# Altium schematic sheet Controller.SchDoc: STM32 Bluepill
size A3; Revision: No; SheetNumber: 1; SheetTotal: 1
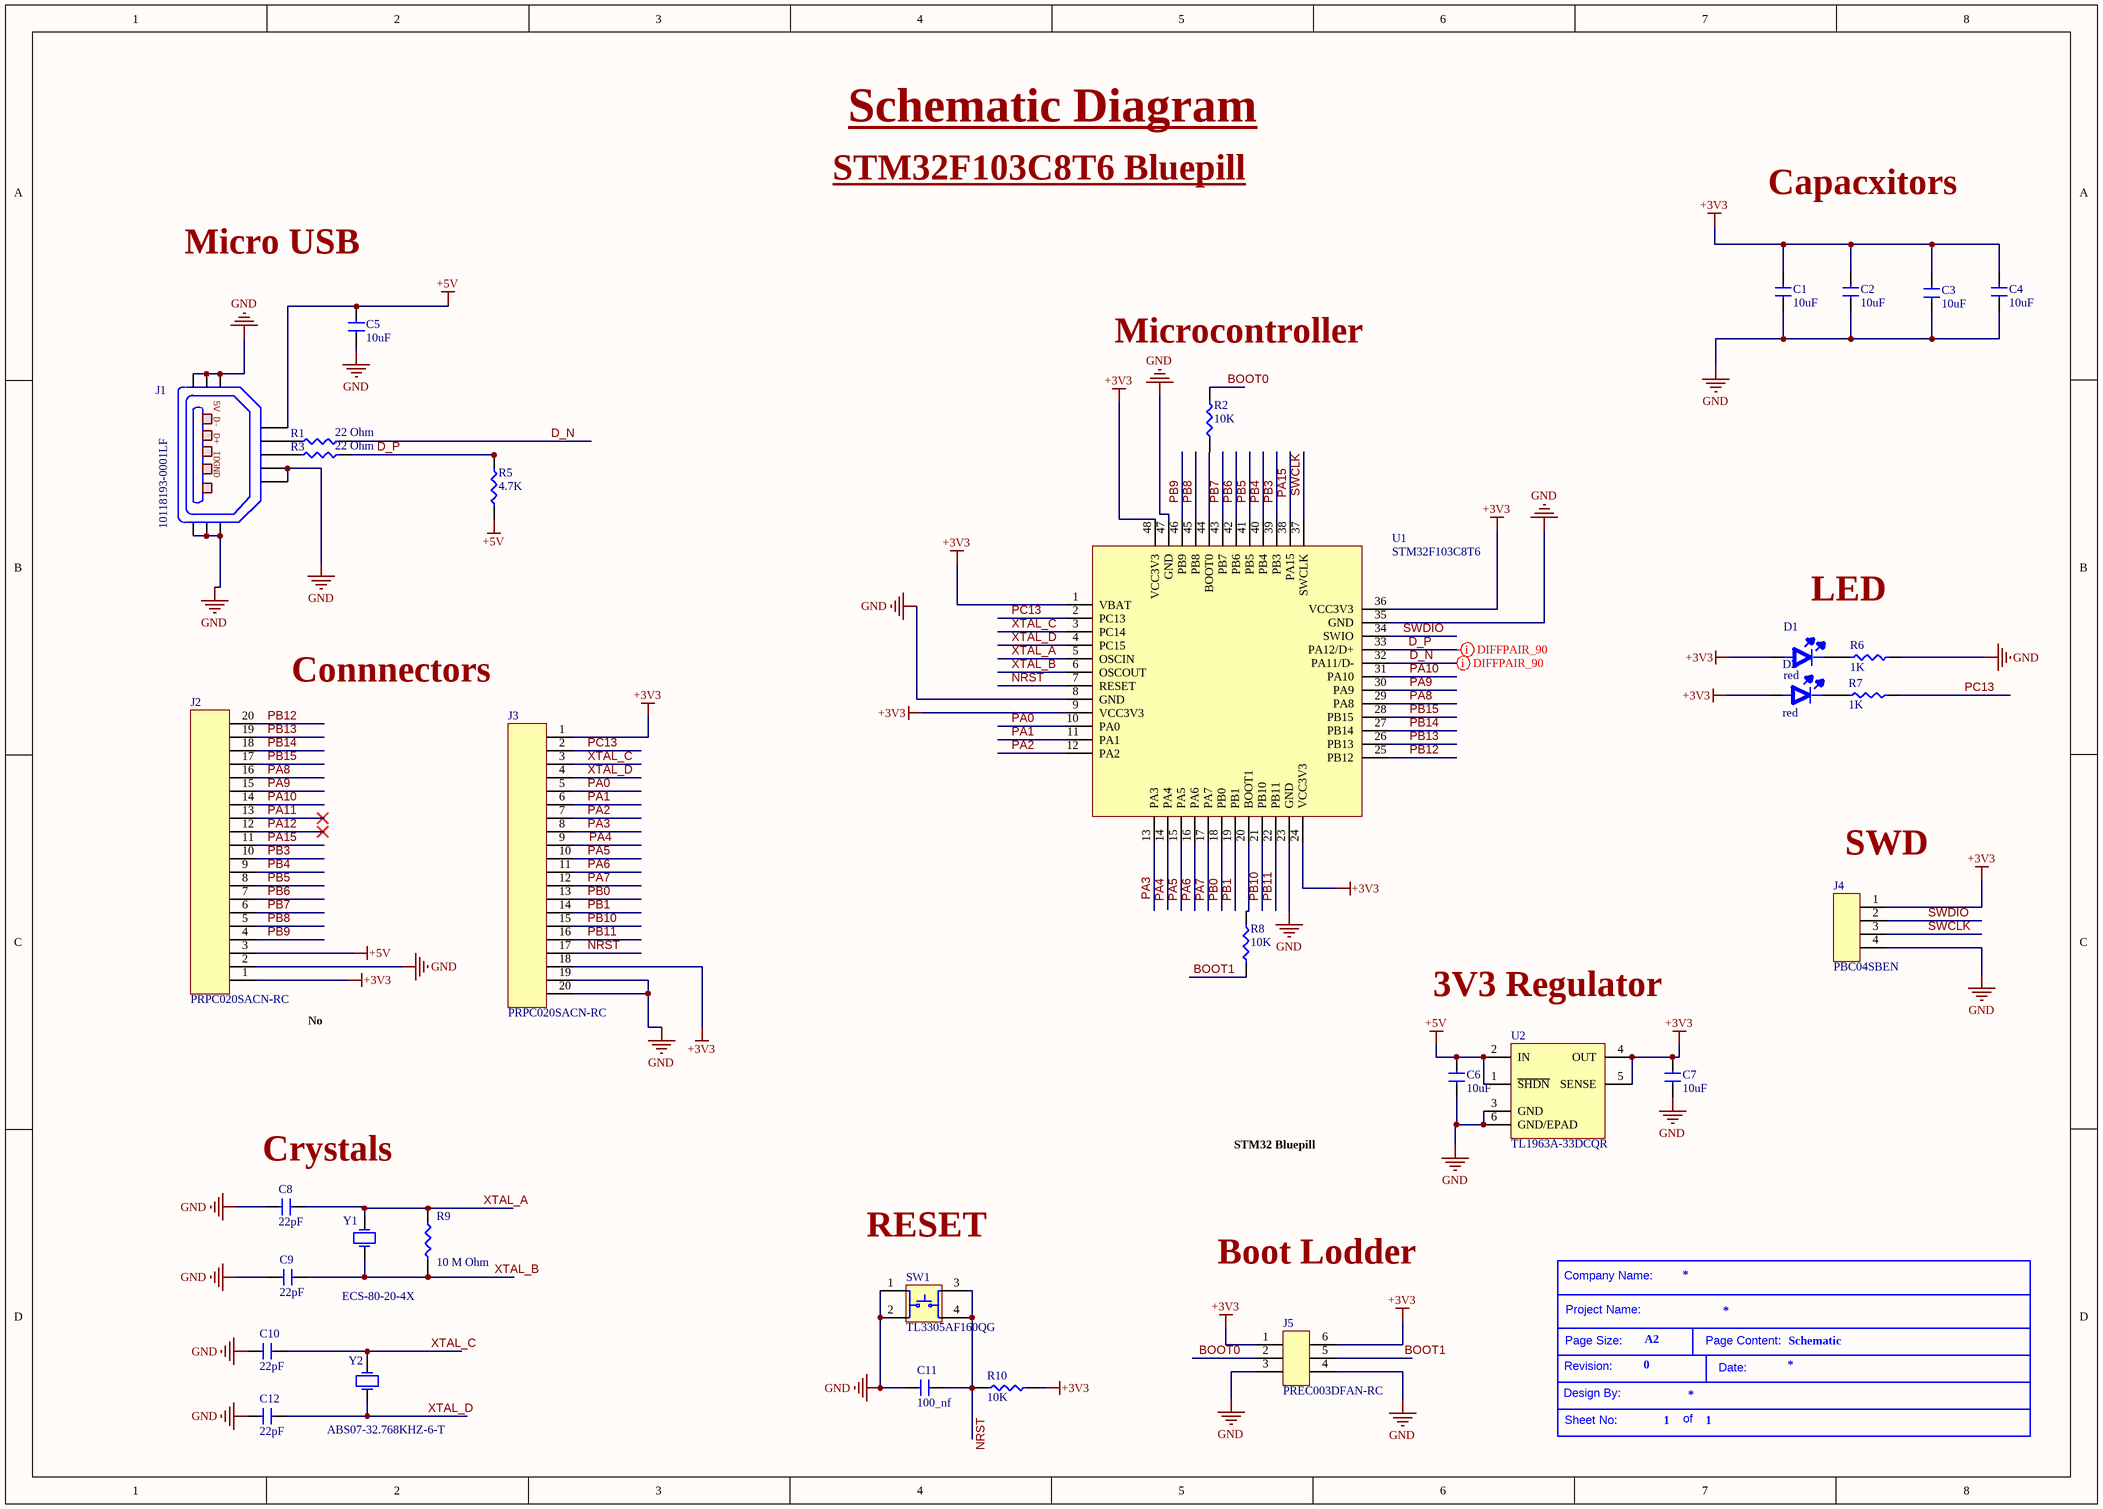
[diagram p0: Controller.SchDoc]

## Parts
*  Title_Block  (value not drawn)  (mechanical)
C1  10uF  [CAP_100_nf]
C2  10uF  [CAP_100_nf]
C3  10uF  [CAP_100_nf]
C4  10uF  [CAP_100_nf]
C5  10uF  [CAP_100_nf]
C6  10uF  [CAP_100_nf]
C7  10uF  [CAP_100_nf]
C8  22pF  [CAP_100_nf]
C9  22pF  [CAP_100_nf]
C10  22pF  [CAP_100_nf]
C11  100_nf  [CAP_100_nf]
C12  22pF  [CAP_100_nf]
D1  red  [LED_RED_0805]
D2  red  [LED_RED_0805]
J1  10118193-0001LF  [USB]
J2  PRPC020SACN-RC  [HDR MALE 20X1 2.54 mm]
J3  PRPC020SACN-RC  [HDR MALE 20X1 2.54 mm]
J4  PBC04SBEN  [HDR MALE 4X1 2.54 mm]
J5  PREC003DFAN-RC  [HDR_MALE_3X2_2.54mm]
R1  22 Ohm  [R0805]
R2  10K  [R0805]
R3  22 Ohm  [R0805]
R5  4.7K  [R0805]
R6  1K  [R0805]
R7  1K  [R0805]
R8  10K  [R0805]
R9  10 M Ohm  [R0805]
R10  10K  [R0805]
SW1  TL3305AF160QG  [SW_PB_SMD]
U1  STM32F103C8T6  [STM32F103C8T6]
U2  TL1963A-33DCQR  [DCQR_PDSO_G6]
Y1  ECS-80-20-4X  [XTAL_8_MHZ]
Y2  ABS07-32.768KHZ-6-T  [XTAL_32.768 KHZ_SMD]

## Nets
+3V3: C1.1 C2.1 C3.1 C4.1 C7.2 D1.2(Anode) D2.2(Anode) J2.1 J3.1 J3.18 J4.1 J5.1 J5.6 R10.2 U1.1(VBAT) U1.9(VCC3V3) U1.24(VCC3V3) U1.36(VCC3V3) U1.48(VCC3V3) U2.4(OUT) U2.5(SENSE)
+5V: C5.1 C6.2 J1.1 J2.3 R5.2 U2.1(~{SHDN}) U2.2(IN)
GND: C1.2 C2.2 C3.2 C4.2 C5.2 C6.1 C7.1 C8.1 C9.1 C10.1 C11.1 C12.1 J1.4 J1.5 J1.6 J1.7 J1.8 J1.9 J1.10 J1.11 J2.2 J3.19 J3.20 J4.4 J5.3 J5.4 R6.2 SW1.1 SW1.2 U1.8(GND) U1.23(GND) U1.35(GND) U1.47(GND) U2.3(GND) U2.6(GND/EPAD)
BOOT0: J5.2 R2.2
BOOT1: J5.5 R8.2
D_N: R1.2 U1.32(PA11/D-)
D_P: R3.2 R5.1 U1.33(PA12/D+)
NRST: C11.2 J3.17 R10.1 SW1.3 SW1.4 U1.7(RESET)
PA0: J3.5 U1.10(PA0)
PA1: J3.6 U1.11(PA1)
PA2: J3.7 U1.12(PA2)
PA3: J3.8 U1.13(PA3)
PA4: J3.9 U1.14(PA4)
PA5: J3.10 U1.15(PA5)
PA6: J3.11 U1.16(PA6)
PA7: J3.12 U1.17(PA7)
PA8: J2.16 U1.29(PA8)
PA9: J2.15 U1.30(PA9)
PA10: J2.14 U1.31(PA10)
PA11: J2.13
PA12: J2.12
PA15: J2.11 U1.38(PA15)
PB0: J3.13 U1.18(PB0)
PB1: J3.14 U1.19(PB1)
PB3: J2.10 U1.39(PB3)
PB4: J2.9 U1.40(PB4)
PB5: J2.8 U1.41(PB5)
PB6: J2.7 U1.42(PB6)
PB7: J2.6 U1.43(PB7)
PB8: J2.5 U1.45(PB8)
PB9: J2.4 U1.46(PB9)
PB10: J3.15 U1.21(PB10)
PB11: J3.16 U1.22(PB11)
PB12: J2.20 U1.25(PB12)
PB13: J2.19 U1.26(PB13)
PB14: J2.18 U1.27(PB14)
PB15: J2.17 U1.28(PB15)
PC13: J3.2 R7.1 U1.2(PC13)
SWCLK: J4.3 U1.37(SWCLK)
SWDIO: J4.2 U1.34(SWIO)
XTAL_A: C8.2 R9.1 U1.5(OSCIN) Y1.1
XTAL_B: C9.2 R9.2 U1.6(OSCOUT) Y1.2
XTAL_C: C10.2 J3.3 U1.3(PC14) Y2.1
XTAL_D: C12.2 J3.4 U1.4(PC15) Y2.2
NetD1_1: D1.1(Cathode) R6.1
NetD2_1: D2.1(Cathode) R7.2
NetJ1_2: J1.2 R1.1
NetJ1_3: J1.3 R3.1
NetR2_1: R2.1 U1.44(BOOT0)
NetR8_1: R8.1 U1.20(BOOT1)

## Layout directives
differential pair; differential pair class diff_90: D_N, D_P

## Notes on the sheet
- Schematic Diagram
- STM32F103C8T6 Bluepill
- Capacxitors
- Micro USB
- (near R2) Microcontroller
- LED
- Connnectors
- (near J4) SWD
- 3V3 Regulator
- Crystals
- (near SW1) RESET
- Boot Lodder
- 0
- A2
- Schematic
- (in symbol Micro_USB) 5V; D-; D+; ID; GND
- (in symbol Title_Block) Company Name:; Project Name:; Page Size:; Page Content:; Revision:; Date:; Design By:; Sheet No:; of

## Library data of the parts
C1-C7 = CAP 10 UF: Cap Ceramic 10uF 16V X7S 10% Pad SMD 0805 Soft Termination 125C Automotive T/R; Manufacturer: Samsung; Manufacturer Part Number: CL21Y106KOQ4PNE; Supplier 1: Digi-Key; RoHS: Yes; Category: Ceramic Capacitors; Stock 1: 1111; Pricing 1: 1=0.50000, 10=0.34800, 50=0.24340, 100=0.20860, 500=0.15646, 1000=0.13213 (USD); RoHS Compliant: Yes; Supplier Part Number 1: 1276-CL21Y106KOQ4PNECT-ND
C8-C10 C12 = CAP_22pF: Cap Ceramic 22pF 50V C0G 0.25pF SMD 0805 125°C Paper T/R; Manufacturer: KEMET; Manufacturer Part Number: C0805C220C5GACTU; Dissipation Factor: 0.1%; Supplier 1: Mouser; RoHS: Yes; Category: Ceramic Capacitors; Stock 1: 504; Pricing 1: 1=0.91000, 10=0.56400, 50=0.56400, 100=0.46200, 1000=0.32200, 10000=0.28100 (USD); Mount: Surface Mount; Case/Package: 0805; Dielectric Material: Ceramic; Case Code (Metric): 2012; Case Code (Imperial): 0805; Min Operating Temperature: -55°C; Max Operating Temperature: 125°C; Capacitance: 22pF; Voltage Rating (DC): 50V; Package Quantity: 4000; Voltage Rating: 50V; Packaging: Tape and Reel; Dielectric: C0G; Termination: SMD/SMT; Series: C0805C; Length: 0.079inch; Width: 0.049inch; Height: 0.78mm; Thickness: 0.035inch; Lead Pitch: 0.75mm; Lead Free: Lead Free; RoHS Compliant: Yes; ComponentLink1URL: https://datasheet.ciiva.com/5420/kem-c1003-c0g-smd-356956-5420078.pdf?src-supplier=Mouser; ComponentLink1Description: https://datasheet.ciiva.com/5420/kem-c1003-c0g-smd-356956-5420078.pdf?src-supplier=Mouser; Supplier Part Number 1: 80-C0805C220C5G
C11 = CAP_ 0.1uf: Cap Ceramic 0.1uF 50V X7R 10% SMD 0805 125°C Blister Plastic T/R; Manufacturer: TDK; Manufacturer Part Number: C2012X7R1H104K125AE; Capacitance: 100nF; Supplier 1: Mouser; RoHS: Yes; Category: Ceramic Capacitors; Stock 1: 49203; Pricing 1: 1=0.25000, 10=0.11500, 50=0.11500, 100=0.09800, 1000=0.06100, 10000=0.05200 (USD); Mount: Surface Mount; Case/Package: 0805; Case Code (Metric): 2012; Case Code (Imperial): 0805; Weight: 0.000194oz; Min Operating Temperature: -55°C; Max Operating Temperature: 125°C; Package Quantity: 2000; Packaging: Tape and Reel; Tolerance: 10%; Voltage Rating: 50V; Dielectric: X7R; Termination: SMD/SMT; Voltage Rating (DC): 50V; Features: Soft Termination; Length: 0.079inch; Width: 0.049inch; Height: 1.25mm; Thickness: 0.057inch; RoHS Compliant: Yes; ComponentLink1URL: https://datasheet.ciiva.com/29534/mlcc-commercial-soft-en-29534235.pdf?src-supplier=Digi-Key; ComponentLink1Description: https://datasheet.ciiva.com/29534/mlcc-commercial-soft-en-29534235.pdf?src-supplier=Digi-Key; Supplier Part Number 1: 810-C2012X7R1H104KAE
D1 D2 = LED_RED: Led SMT Red 0805 Tape; Manufacturer: Osram Opto; Manufacturer Part Number: LSR976-NR-1; Lens Color: White; Forward Current: 25mA; Forward Voltage: 2.5V; Luminous Intensity: 180mcd; Viewing Angle: 160°; Lens Style: Flat,Diffused,Colorless,Rectangular; Test Current: 20mA; Dominant Wavelength: 633nm; Luminous Flux: 0.47lm; Number of Elements: 1; Reverse Voltage: 12V; Power Dissipation: 65mW; Lens Transparency: Diffused; Lens Size: 1.25mm; Supplier 1: Avnet; RoHS: Yes; Category: LEDs; Stock 1: 360000; Pricing 1: 4000=0.03250, 8000=0.03167, 16000=0.03084, 24000=0.03002, 32000=0.02919, 40000=0.02836, 400000=0.02753 (USD); Mount: Surface Mount; Case/Package: 0805; Number of Pins: 2; Color: Red; Case Code (Metric): 2012; Case Code (Imperial): 0805; Min Operating Temperature: -30°C; Max Operating Temperature: 85°C; Packaging: Tape and Reel; Number of LEDs: 1; Illumination Color: Red; Package Quantity: 16000; Series: CHIPLED 0805; Length: 2.1mm; Width: 1.25mm; Height: 0.9mm; Depth: 1.35mm; Radiation Hardening: No; RoHS Compliant: Yes; ComponentLink1URL: https://datasheet.ciiva.com/4688/o-ls-ly-r976-24152-4688435.pdf?src-supplier=Mouser; ComponentLink1Description: https://datasheet.ciiva.com/4688/o-ls-ly-r976-24152-4688435.pdf?src-supplier=Mouser; ComponentLink2URL: https://datasheet.ciiva.com/26920/getdatasheetpartid-568367-26920831.pdf?src-supplier=Verical; ComponentLink2Description: https://datasheet.ciiva.com/26920/getdatasheetpartid-568367-26920831.pdf?src-supplier=Verical; ComponentLink3URL: https://datasheet.ciiva.com/2112/00078896-0-2112782.pdf?src-supplier=Digi-Key; ComponentLink3Description: https://datasheet.ciiva.com/2112/00078896-0-2112782.pdf?src-supplier=Digi-Key; ComponentLink4URL: https://datasheet.ciiva.com/2112/00078896-0-2112781.pdf?src-supplier=Digi-Key; ComponentLink4Description: https://datasheet.ciiva.com/2112/00078896-0-2112781.pdf?src-supplier=Digi-Key; ComponentLink5URL: https://datasheet.ciiva.com/2112/00078896-0-2112783.pdf?src-supplier=Digi-Key; ComponentLink5Description: https://datasheet.ciiva.com/2112/00078896-0-2112783.pdf?src-supplier=Digi-Key; Supplier Part Number 1: Q62702P5178
J1 = Micro_USB: FCI Right Angle Surface Mount Mount Female USB Connector; 100 V ac; 1.8A; Manufacturer: Amphenol ICC / FCI; Supplier 1: RSComponents; Manufacturer Part Number: 10118193-0001LF; RoHS: No; Category: USB Connectors; Stock 1: 3200; Pricing 1: 100=0.34100, 500=0.29900, 1000=0.25600, 2500=0.23900, 5000=0.22100 (USD); ComponentLink1URL: http://uk.rs-online.com/webdocs/1450/0900766b814507f1.pdf?src-supplier=RSComponents; ComponentLink1Description: http://uk.rs-online.com/webdocs/1450/0900766b814507f1.pdf?src-supplier=RSComponents; ComponentLink2URL: http://www.amphenol-icc.com/media/wysiwyg/files/drawing/10118193.pdf?src-supplier=Digi-Key; ComponentLink2Description: http://www.amphenol-icc.com/media/wysiwyg/files/drawing/10118193.pdf?src-supplier=Digi-Key; ComponentLink3URL: https://cdn.amphenol-icc.com/media/wysiwyg/files/documentation/datasheet/inputoutput/io_usb_micro.pdf?src-supplier=Digi-Key; ComponentLink3Description: https://cdn.amphenol-icc.com/media/wysiwyg/files/documentation/datasheet/inputoutput/io_usb_micro.pdf?src-supplier=Digi-Key; ComponentLink4URL: https://cdn.amphenol-icc.com/media/wysiwyg/files/documentation/datasheet/inputoutput/io_usb_micro.pdf?src-supplier=Mouser; ComponentLink4Description: https://cdn.amphenol-icc.com/media/wysiwyg/files/documentation/datasheet/inputoutput/io_usb_micro.pdf?src-supplier=Mouser; ComponentLink5URL: https://cdn.amphenol-icc.com/media/wysiwyg/files/documentation/datasheet/inputoutput/io_usb_micro.pdf?src-supplier=Onlinecomponents.com; ComponentLink5Description: https://cdn.amphenol-icc.com/media/wysiwyg/files/documentation/datasheet/inputoutput/io_usb_micro.pdf?src-supplier=Onlinecomponents.com; ComponentLink6URL: https://cdn.amphenol-icc.com/media/wysiwyg/files/documentation/datasheet/inputoutput/io_usb_micro.pdf?src-supplier=Allied+Electronics; ComponentLink6Description: https://cdn.amphenol-icc.com/media/wysiwyg/files/documentation/datasheet/inputoutput/io_usb_micro.pdf?src-supplier=Allied+Electronics; ComponentLink7URL: https://cdn.amphenol-icc.com/media/wysiwyg/files/documentation/datasheet/inputoutput/io_usb_micro.pdf?src-supplier=RSComponents; ComponentLink7Description: https://cdn.amphenol-icc.com/media/wysiwyg/files/documentation/datasheet/inputoutput/io_usb_micro.pdf?src-supplier=RSComponents; ComponentLink8URL: https://cdn.amphenol-icc.com/media/wysiwyg/files/documentation/datasheet/inputoutput/io_usb_micro.pdf?src-supplier=Verical; ComponentLink8Description: https://cdn.amphenol-icc.com/media/wysiwyg/files/documentation/datasheet/inputoutput/io_usb_micro.pdf?src-supplier=Verical; ComponentLink9URL: https://cdn.amphenol-icc.com/media/wysiwyg/files/documentation/datasheet/inputoutput/io_usb_micro.pdf?src-supplier=Avnet; ComponentLink9Description: https://cdn.amphenol-icc.com/media/wysiwyg/files/documentation/datasheet/inputoutput/io_usb_micro.pdf?src-supplier=Avnet; ComponentLink10URL: https://cdn.amphenol-icc.com/media/wysiwyg/files/documentation/datasheet/inputoutput/io_usb_micro.pdf?src-supplier=Arrow+Electronics; ComponentLink10Description: https://cdn.amphenol-icc.com/media/wysiwyg/files/documentation/datasheet/inputoutput/io_usb_micro.pdf?src-supplier=Arrow+Electronics; ComponentLink11URL: https://cdn.amphenol-icc.com/media/wysiwyg/files/documentation/datasheet/inputoutput/io_usb_micro.pdf?src-supplier=TTI; ComponentLink11Description: https://cdn.amphenol-icc.com/media/wysiwyg/files/documentation/datasheet/inputoutput/io_usb_micro.pdf?src-supplier=TTI; ComponentLink12URL: https://cdn.amphenol-icc.com/media/wysiwyg/files/documentation/datasheet/inputoutput/io_usb_micro.pdf?src-supplier=Heilind+Electronics; ComponentLink12Description: https://cdn.amphenol-icc.com/media/wysiwyg/files/documentation/datasheet/inputoutput/io_usb_micro.pdf?src-supplier=Heilind+Electronics; ComponentLink13URL: https://cdn.amphenol-icc.com/media/wysiwyg/files/documentation/datasheet/inputoutput/io_usb_micro.pdf?src-supplier=TME; ComponentLink13Description: https://cdn.amphenol-icc.com/media/wysiwyg/files/documentation/datasheet/inputoutput/io_usb_micro.pdf?src-supplier=TME; Supplier Part Number 1: 8632989
J2 J3 = MALE_HEADER_20X1: Conn Header Vert 20POS 2.54MM; Manufacturer: Sullins; Number of Positions: 20; Connector Type: Male Pin; Pitch: 0.1inch; Supplier 1: Digi-Key; Manufacturer Part Number: PRPC020SACN-RC; RoHS: Yes; Category: Connectors; Stock 1: 612; Pricing 1: 1=0.67000, 10=0.62800, 25=0.56520, 50=0.50260, 100=0.48160, 250=0.43976, 500=0.41880 (USD); Mount: Through Hole; Color: Black; Contact Plating: Gold; Package Quantity: 1; Number of Rows: 1; Packaging: Bulk; Termination: Solder; Series: -; Contact Type: Male Pin; Contact Mating Length: 0.23inch; RoHS Compliant: Yes; ComponentLink1URL: https://datasheet.ciiva.com/741/xrxczzzsxxn-rc-st-11635-b-741945.pdf?src-supplier=Digi-Key; ComponentLink1Description: https://datasheet.ciiva.com/741/xrxczzzsxxn-rc-st-11635-b-741945.pdf?src-supplier=Digi-Key; Supplier Part Number 1: S1131EC-20-ND
J4 = HDR_MALE_4X1: Conn Header R/a 4POS 2.54MM; Manufacturer: Sullins; Number of Positions: 4; Gender: Male; Connector Type: Male Pin; Pitch: 0.1inch; Supplier 1: Digi-Key; Manufacturer Part Number: PBC04SBEN; RoHS: Yes; Category: Connectors; Stock 1: 668; Pricing 1: 1=0.84000, 10=0.73800, 25=0.69440, 50=0.66540, 100=0.63650, 250=0.57868, 500=0.52080 (USD); Mount: Through Hole; Color: Black; Contact Plating: Gold; Housing Color: Black; Contact Material: Bronze; Housing Material: Plastic; Package Quantity: 1; Number of Rows: 1; Packaging: Bulk; Termination: Solder; Number of Contacts: 4; Contact Type: Male Pin; Length: 10.2mm; Width: 2.54mm; Height: 3.56mm; Contact Mating Length: 0.23inch; Lead Free: Lead Free; RoHS Compliant: Yes; ComponentLink1URL: http://www.sullinscorp.com/catalogs/77_PAGE108-109_.100_MALE_HDR.pdf?src-supplier=Digi-Key; ComponentLink1Description: http://www.sullinscorp.com/catalogs/77_PAGE108-109_.100_MALE_HDR.pdf?src-supplier=Digi-Key; Supplier Part Number 1: S1151E-04-ND
J5 = HDR_MALE_3X2: Conn Header Vert 6POS 2.54MM; Manufacturer: Sullins; Number of Positions: 6; Connector Type: Male Pin; Pitch: 0.1inch; Supplier 1: Digi-Key; Manufacturer Part Number: PREC003DFAN-RC; RoHS: Yes; Category: Connectors; Stock 1: 4091; Pricing 1: 1=0.16000, 10=0.15100, 25=0.12920, 50=0.11280, 100=0.10480, 250=0.09272, 500=0.08870 (USD); Mount: Through Hole; Color: Black; Contact Plating: Tin; Package Quantity: 1; Number of Rows: 2; Packaging: Bulk; Termination: Solder; Contact Type: Male Pin; Row Spacing: 0.1inch; Contact Mating Length: 0.318inch; RoHS Compliant: Yes; ComponentLink1URL: https://datasheet.ciiva.com/741/xrxczzzdxxn-rc-11636-b-741002.pdf?src-supplier=Digi-Key; ComponentLink1Description: https://datasheet.ciiva.com/741/xrxczzzdxxn-rc-11636-b-741002.pdf?src-supplier=Digi-Key; Supplier Part Number 1: S2212EC-03-ND
R1 R3 = Res 22Ohm: 贴片电阻 22Ω ± 1.00% 0.125W ± 100ppm/℃ 0805; Manufacturer: Yageo; Manufacturer Part Number: RC0805FR-0722RL; Resistance: 22R; Tolerance: 1%; Temperature Coefficient: 100ppm/°C; Power Rating: 125mW; Voltage Rating: 150V; Supplier 1: RSComponents; RoHS: Yes; Category: Chip SMD Resistors; Stock 1: 50000; Pricing 1: 5000=0.01300 (USD); Case/Package: 0805; Case Code (Metric): 2012; Case Code (Imperial): 0805; Min Operating Temperature: -55°C; Max Operating Temperature: 155°C; Resistor Type: Thick Film; Packaging: Tape and Reel; Package Quantity: 1; Number of Terminations: 2; Termination: SMD/SMT; Max Power Dissipation: 125mW; Working Voltage: 150V; Features: Moisture Resistant; Series: RC; Resistance Tolerance: 1%; Construction: Rectangular; Technology: THICK FILM; Length: 0.079inch; Width: 0.049inch; Height: 0.024inch; Depth: 1.25mm; REACH SVHC: Unknown; Lead Free: Lead Free; RoHS Compliant: Yes; Military Standard: Not; ComponentLink1URL: https://datasheet.ciiva.com/11819/0900766b8106beab-11819837.pdf?src-supplier=RSComponents; ComponentLink1Description: https://datasheet.ciiva.com/11819/0900766b8106beab-11819837.pdf?src-supplier=RSComponents; ComponentLink2URL: https://datasheet.ciiva.com/46447/444164-46447574.pdf?src-supplier=Element14; ComponentLink2Description: https://datasheet.ciiva.com/46447/444164-46447574.pdf?src-supplier=Element14; ComponentLink3URL: https://datasheet.ciiva.com/2457/pyu-r-int-thick-7-2457045.pdf?src-supplier=Digi-Key; ComponentLink3Description: https://datasheet.ciiva.com/2457/pyu-r-int-thick-7-2457045.pdf?src-supplier=Digi-Key; ComponentLink4URL: https://datasheet.ciiva.com/2457/pyu-r-int-thick-7-2457046.pdf?src-supplier=Digi-Key; ComponentLink4Description: https://datasheet.ciiva.com/2457/pyu-r-int-thick-7-2457046.pdf?src-supplier=Digi-Key; ComponentLink5URL: https://datasheet.ciiva.com/2457/pyu-r-int-thick-7-2457044.pdf?src-supplier=Digi-Key; ComponentLink5Description: https://datasheet.ciiva.com/2457/pyu-r-int-thick-7-2457044.pdf?src-supplier=Digi-Key; ComponentLink6URL: https://datasheet.ciiva.com/12667/rc0805-12667371.pdf?src-supplier=Mouser; ComponentLink6Description: https://datasheet.ciiva.com/12667/rc0805-12667371.pdf?src-supplier=Mouser; Supplier Part Number 1: 6183987
R2 R8 R10 = Res_10K: Res Thin Film 0805 10K Ohm 0.1% 1/8W ±50ppm/°C Molded SMD SMD Paper T/R; Manufacturer: Yageo; Manufacturer Part Number: RT0805BRE0710KL; Resistance: 10kR; Power Rating: 125mW; Voltage Rating: 150V; Supplier 1: Newark; RoHS: Yes; Category: Chip SMD Resistors; Stock 1: 9400; Pricing 1: 10=0.27000, 25=0.21800, 50=0.16600, 100=0.11400 (USD); Case/Package: 0805; Case Code (Metric): 2012; Case Code (Imperial): 0805; Weight: 0.000194oz; Contact Plating: Tin,Matte; Size Code: 0805; Min Operating Temperature: -55°C; Max Operating Temperature: 125°C; Package Quantity: 5000; Packaging: Tape and Reel; Resistor Type: Thin Film; Number of Terminations: 2; Termination: SMD/SMT; Max Power Dissipation: 125mW; Temperature Coefficient: 50ppm/°C; Voltage Rating (DC): 150V; Features: Moisture Resistant; Series: RT; Length: 0.079inch; Width: 0.049inch; Height: 0.024inch; Radiation Hardening: No; Lead Free: Lead Free; RoHS Compliant: Yes; ComponentLink1URL: https://datasheet.ciiva.com/2591/pyu-rt-1-to-0-05-rohs-l-5-2591441.pdf?src-supplier=Digi-Key; ComponentLink1Description: https://datasheet.ciiva.com/2591/pyu-rt-1-to-0-05-rohs-l-5-2591441.pdf?src-supplier=Digi-Key; ComponentLink2URL: https://datasheet.ciiva.com/12836/pyu-rt-1-to-0-05-rohs-l-4-12836453.pdf?src-supplier=Mouser; ComponentLink2Description: https://datasheet.ciiva.com/12836/pyu-rt-1-to-0-05-rohs-l-4-12836453.pdf?src-supplier=Mouser; Supplier Part Number 1: 82AH9025
R5 = Res 4.7 K: Res Thick Film 0805 4.7K Ohm 1% 0.125W ±100ppm/°C Molded SMD Paper T/R; Manufacturer: Stackpole Electronics; Manufacturer Part Number: RMCF0805FT4K70; Resistance: 4.7kR; Power Rating: 125mW; Supplier 1: Avnet; RoHS: Yes; Category: Chip SMD Resistors; Stock 1: 3000000; Pricing 1: 5000=0.00256, 10000=0.00252, 20000=0.00245, 30000=0.00239, 40000=0.00230, 50000=0.00225, 500000=0.00220 (USD); Mount: Surface Mount; Case/Package: 0805; Case Code (Metric): 2012; Case Code (Imperial): 0805; Contact Plating: Tin,Matte; Size Code: 0805; Min Operating Temperature: -55°C; Max Operating Temperature: 155°C; Tolerance: 1%; Packaging: Tape and Reel; Resistor Type: Thick Film; Number of Terminations: 2; Max Power Dissipation: 125mW; Temperature Coefficient: 100ppm/°C; Features: Automotive AEC-Q200; Series: RMCF; Construction: Rectangular; Length: 2mm; Width: 0.049inch; Height: 0.026inch; Depth: 1.25mm; Radiation Hardening: No; Military Standard: Not; Lead Free: Lead Free; RoHS Compliant: Yes; ComponentLink1URL: https://www.seielect.com/Catalog/SEI-RMCF_RMCP.pdf?src-supplier=Digi-Key; ComponentLink1Description: https://www.seielect.com/Catalog/SEI-RMCF_RMCP.pdf?src-supplier=Digi-Key; ComponentLink2URL: https://www.verical.com/server-webapp/html/getDatasheet?partID=409513&src-supplier=Verical; ComponentLink2Description: https://www.verical.com/server-webapp/html/getDatasheet?partID=409513&src-supplier=Verical; ComponentLink3URL: https://www.seielect.com/catalog/SEI-RMCF_RMCP.pdf?src-supplier=Avnet; ComponentLink3Description: https://www.seielect.com/catalog/SEI-RMCF_RMCP.pdf?src-supplier=Avnet; ComponentLink4URL: http://www.seielect.com/catalog/sei-rmc.pdf?src-supplier=Future+Electronics; ComponentLink4Description: http://www.seielect.com/catalog/sei-rmc.pdf?src-supplier=Future+Electronics; ComponentLink5URL: https://www.seielect.com/catalog/SEI-Packaging.pdf?src-supplier=Digi-Key; ComponentLink5Description: https://www.seielect.com/catalog/SEI-Packaging.pdf?src-supplier=Digi-Key; ComponentLink6URL: http://components.arrow.com/part/dataview/44988207S7163511N1174?src-supplier=Arrow+Electronics; ComponentLink6Description: http://components.arrow.com/part/dataview/44988207S7163511N1174?src-supplier=Arrow+Electronics; Supplier Part Number 1: RMCF0805FT4K70
R6 R7 = Res_1K: Res Thick Film 0805 1K Ohm 1% 0.125W(1/8W) ±100ppm/C Pad SMD T/R; Manufacturer: Yageo; Manufacturer Part Number: RC0805FR-071KP; Resistance: 1kR; Max Power Dissipation: 125mW; Temperature Coefficient: 100ppm/°C; Supplier 1: Mouser; RoHS: Yes; Category: Chip SMD Resistors; Stock 1: 2868; Pricing 1: 1=0.22000, 10=0.07500, 50=0.07500, 100=0.03100, 1000=0.01400, 10000=0.00900 (USD); Case/Package: 0805; Case Code (Metric): 2012; Case Code (Imperial): 0805; Min Operating Temperature: -55°C; Max Operating Temperature: 155°C; Packaging: Tape and Reel; Resistor Type: Thick Film; Number of Terminations: 2; Tolerance: 1%; Features: Moisture Resistant; Length: 0.079inch; Width: 0.049inch; Height: 0.024inch; RoHS Compliant: Yes; ComponentLink1URL: http://www.yageo.com.tw/exep/pages/download/literatures/PYu-R_INT-thick_7.pdf?src-supplier=Digi-Key; ComponentLink1Description: http://www.yageo.com.tw/exep/pages/download/literatures/PYu-R_INT-thick_7.pdf?src-supplier=Digi-Key; ComponentLink2URL: http://www.yageo.com/NewPortal/yageodocoutput?fileName=/pdf/R-Chip/PYu-RC_51_RoHS_P_0.pdf&src-supplier=Digi-Key; ComponentLink2Description: http://www.yageo.com/NewPortal/yageodocoutput?fileName=/pdf/R-Chip/PYu-RC_51_RoHS_P_0.pdf&src-supplier=Digi-Key; Supplier Part Number 1: 603-RC0805FR-071KP
R9 = Res_10 M_Ohm: 贴片电阻 10000000Ω ± 1.00% 0.125W ± 100ppm/℃ 0805; Manufacturer: Yageo; Manufacturer Part Number: RC0805FR-0710ML; Voltage Rating: 150V; Power Rating: 125mW; Tolerance: 1%; Resistance: 10MR; Temperature Coefficient: 100ppm/°C; Supplier 1: Mouser; RoHS: Yes; Category: Chip SMD Resistors; Stock 1: 4; Pricing 1: 1=0.10000, 10=0.03900, 50=0.03900, 100=0.01600, 1000=0.00800, 2500=0.00700, 5000=0.00500, 10000=0.00400 (USD); Case/Package: 0805; Number of Pins: 2; Case Code (Imperial): 0805; Case Code (Metric): 2012; Min Operating Temperature: -55°C; Max Operating Temperature: 155°C; Packaging: Tape and Reel; Voltage Rating (DC): 150V; Termination: SMD/SMT; Resistor Type: Thick Film; Working Voltage: 150V; Number of Terminations: 2; Features: Moisture Resistant; Series: RC; Max Power Dissipation: 125mW; Resistance Tolerance: 1%; Technology: THICK FILM; Construction: Rectangular; Length: 2mm; Width: 1.25mm; Height: 0.5mm; Depth: 1.25mm; REACH SVHC: Unknown; Military Standard: Not; Lead Free: Lead Free; RoHS Compliant: Yes; ComponentLink1URL: https://datasheet.ciiva.com/11819/0900766b8106beab-11819794.pdf?src-supplier=RSComponents; ComponentLink1Description: https://datasheet.ciiva.com/11819/0900766b8106beab-11819794.pdf?src-supplier=RSComponents; ComponentLink2URL: https://datasheet.ciiva.com/46447/444164-46447564.pdf?src-supplier=Element14; ComponentLink2Description: https://datasheet.ciiva.com/46447/444164-46447564.pdf?src-supplier=Element14; ComponentLink3URL: https://datasheet.ciiva.com/12667/rc0805-12667934.pdf?src-supplier=Mouser; ComponentLink3Description: https://datasheet.ciiva.com/12667/rc0805-12667934.pdf?src-supplier=Mouser; ComponentLink4URL: https://datasheet.ciiva.com/7941/444164-7941686.pdf?src-supplier=Element14; ComponentLink4Description: https://datasheet.ciiva.com/7941/444164-7941686.pdf?src-supplier=Element14; ComponentLink5URL: https://datasheet.ciiva.com/7941/444164-7941685.pdf?src-supplier=Element14; ComponentLink5Description: https://datasheet.ciiva.com/7941/444164-7941685.pdf?src-supplier=Element14; ComponentLink6URL: https://datasheet.ciiva.com/16741/rc0805-16741023.pdf?src-supplier=Future+Electronics; ComponentLink6Description: https://datasheet.ciiva.com/16741/rc0805-16741023.pdf?src-supplier=Future+Electronics; Supplier Part Number 1: 603-RC0805FR-0710ML
SW1 = SW_PB: TL3305A Series SPST 12 V 4.5 x 4.5 mm 160 gf Top Actuated SMT Tactile Switch; Manufacturer: E-Switch; Supplier 1: Newark; Manufacturer Part Number: TL3305AF160QG; RoHS: Yes; Category: Tactile Switches; Stock 1: 12000; Pricing 1: 1=0.22100, 10=0.21500, 25=0.20400, 50=0.19400, 100=0.18500, 250=0.16800 (USD); ComponentLink1URL: http://www.farnell.com/datasheets/2554191.pdf?src-supplier=Farnell; ComponentLink1Description: http://www.farnell.com/datasheets/2554191.pdf?src-supplier=Farnell; ComponentLink2URL: http://www.farnell.com/datasheets/2554191.pdf?src-supplier=Newark; ComponentLink2Description: http://www.farnell.com/datasheets/2554191.pdf?src-supplier=Newark; ComponentLink3URL: http://spec_sheets.e-switch.com/specs/P010468.pdf?src-supplier=Digi-Key; ComponentLink3Description: http://spec_sheets.e-switch.com/specs/P010468.pdf?src-supplier=Digi-Key; Supplier Part Number 1: 84Y2774
U1 = STM32F103C8T6: IC MCU 32BIT 64KB FLASH 48LQFP; Manufacturer: STMicroelectronics; RAM Size: 20KB; Frequency: 72MHz; Max Power Dissipation: 363mW; Interface: I2C,SPI,USB,CAN,USART; Number of I/Os: 37; Number of Timers/Counters: 3; Max Supply Voltage: 3.6V; Number of ADC Channels: 10; Min Supply Voltage: 2V; Oscillator Type: Internal; Number of Programmable I/O: 48; Data Bus Width: 32b; Number of Bits: 32; Watchdog Timer: Yes; Peripherals: POR,PWM,WDT,DMA,Temp Sensor,I2C; Core Architecture: ARM; Number of PWM Channels: 1; Number of SPI Channels: 2; Supplier 1: Newark; Manufacturer Part Number: STM32F103C8T6; RoHS: Yes; Category: Microcontrollers; Pricing 1: 1=9.19000, 10=8.25000, 25=7.80000, 50=7.28000, 100=6.76000, 250=6.41000 (USD); Case/Package: LQFP; Number of Pins: 48; Weight: 0.006349oz; Min Operating Temperature: -40°C; Max Operating Temperature: 85°C; Packaging: Tray; Package Quantity: 1500; Density: 64KB; Memory Type: FLASH; Max Frequency: 72MHz; Memory Size: 64KB; Series: STM32F103C8; Termination: SMD/SMT; Number of I2C Channels: 2; Address Bus Width: 32b; Length: 7mm; Width: 7mm; Height: 1.4mm; Radiation Hardening: No; Lead Free: Lead Free; REACH SVHC: No SVHC; RoHS Compliant: Yes; ComponentLink1URL: https://datasheet.ciiva.com/15122/getdatasheetpartid-69880-15122076.pdf?src-supplier=Verical; ComponentLink1Description: https://datasheet.ciiva.com/15122/getdatasheetpartid-69880-15122076.pdf?src-supplier=Verical; ComponentLink2URL: https://datasheet.ciiva.com/8054/1730126-8054942.pdf?src-supplier=Element14; ComponentLink2Description: https://datasheet.ciiva.com/8054/1730126-8054942.pdf?src-supplier=Element14; ComponentLink3URL: https://datasheet.ciiva.com/14100/pustm-arm-microcont-stm32f103-en-14100508.pdf?src-supplier=Distrelec; ComponentLink3Description: https://datasheet.ciiva.com/14100/pustm-arm-microcont-stm32f103-en-14100508.pdf?src-supplier=Distrelec; ComponentLink4URL: https://datasheet.ciiva.com/16210/cd00161566-16210248.pdf?src-supplier=Future+Electronics; ComponentLink4Description: https://datasheet.ciiva.com/16210/cd00161566-16210248.pdf?src-supplier=Future+Electronics; ComponentLink5URL: https://datasheet.ciiva.com/48687/001075658-da-01-en-mcu-64kb-mem-stm32f103c8t6-lqfp-48-stm-48687589.pdf?src-supplier=Conrad; ComponentLink5Description: https://datasheet.ciiva.com/48687/001075658-da-01-en-mcu-64kb-mem-stm32f103c8t6-lqfp-48-stm-48687589.pdf?src-supplier=Conrad; Supplier Part Number 1: 59M2182
U2 = 3V3 Regulator: LDO Regulator Pos 3.3V 1.5A 6-Pin(5+Tab) SOT-223 T/R; Manufacturer: Texas Instruments; Dropout Voltage: 340mV; Number of Outputs: 1; Max Input Voltage: 20V; Min Input Voltage: 2.1V; Min Current Limit: 1.6A; Input Bias Current: 1mA; Polarity: Positive; Accuracy: 3%; Output Type: Fixed; Supplier 1: Mouser; Manufacturer Part Number: TL1963A-33DCQR; RoHS: Yes; Category: Voltage Regulators - Linear; Pricing 1: 1=3.62000, 10=3.26000, 50=3.08000, 100=2.67000, 1000=1.99000, 10000=1.98000 (USD); Case/Package: SOT-223; Number of Pins: 6; Contact Plating: Gold; Min Operating Temperature: -40°C; Max Operating Temperature: 125°C; Package Quantity: 1; Packaging: Tape and Reel; Output Voltage: 3.3V; Output Current: 1.5A; Max Output Current: 1.5A; Number of Regulators: 1; Quiescent Current: 1mA; Max Output Voltage: 3.3V; Min Output Voltage: 3.3V; Series: -; Radiation Hardening: No; Lead Free: Lead Free; RoHS Compliant: Yes; ComponentLink1URL: https://datasheet.ciiva.com/2046/tl1963a-2046162.pdf?src-supplier=Digi-Key; ComponentLink1Description: https://datasheet.ciiva.com/2046/tl1963a-2046162.pdf?src-supplier=Digi-Key; ComponentLink2URL: https://datasheet.ciiva.com/2046/tl1963a-2046161.pdf?src-supplier=Digi-Key; ComponentLink2Description: https://datasheet.ciiva.com/2046/tl1963a-2046161.pdf?src-supplier=Digi-Key; ComponentLink3URL: https://datasheet.ciiva.com/2046/tl1963a-2046163.pdf?src-supplier=Digi-Key; ComponentLink3Description: https://datasheet.ciiva.com/2046/tl1963a-2046163.pdf?src-supplier=Digi-Key; Supplier Part Number 1: 595-TL1963A-33DCQR
Y1 = Xtal_8MHZ: Crystal 8MHz ±30ppm (Tol) ±50ppm (Stability) 20pF FUND 80Ohm 2-Pin HC-49/USX Thru-Hole Bulk; Manufacturer: ECS International; ESR (Equivalent Series Resistance): 80R; Supplier 1: Avnet; Manufacturer Part Number: ECS-80-20-4X; RoHS: Yes; Category: Oscillators; Stock 1: 5000; Pricing 1: 200=0.33350, 210=0.32430, 410=0.31510, 1000=0.30590, 2000=0.29670 (USD); Mount: Through Hole; Number of Pins: 49; Weight: 0.019667oz; Min Operating Temperature: -10°C; Max Operating Temperature: 70°C; Package Quantity: 200; Series: HCS-49USX; Frequency: 8MHz; Packaging: Bulk; Termination: Radial; Load Capacitance: 20pF; Tolerance: 30ppm; Frequency Tolerance: 30ppm; Frequency Stability: 50ppm; Length: 11.35mm; Width: 4.65mm; Height: 3.5mm; RoHS Compliant: No; Lead Free: Lead Free; ComponentLink1URL: https://datasheet.ciiva.com/853/hc-49usx-853353.pdf?src-supplier=Digi-Key; ComponentLink1Description: https://datasheet.ciiva.com/853/hc-49usx-853353.pdf?src-supplier=Digi-Key; Supplier Part Number 1: ECS-80-20-4X
Y2 = XTAl_32.768_KHZ: Crystal 0.032768MHz ±20ppm (Tol) 6pF Flexural 70000Ohm 2-Pin CSMD T/R; Manufacturer: Abracon; ESR (Equivalent Series Resistance): 70kR; Supplier 1: Newark; Manufacturer Part Number: ABS07-32.768KHZ-6-T; RoHS: Yes; Category: Crystals; Stock 1: 12000; Pricing 1: 1=0.84600, 3000=0.84600 (USD); Mount: Surface Mount; Case/Package: CSMD; Number of Pins: 2; Min Operating Temperature: -40°C; Max Operating Temperature: 85°C; Frequency: 32.768kHz; Load Capacitance: 6pF; Packaging: Tape and Reel; Frequency Tolerance: 20ppm; Package Quantity: 3000; Tolerance: 20ppm; Termination: SMD/SMT; Series Resistance: 70kR; Series: ABS07; Operating Frequency: 32.768 kHz; Length: 3.2mm; Width: 0.061inch; Height: 0.035inch; Depth: 1.5mm; Radiation Hardening: No; RoHS Compliant: Yes; Lead Free: Lead Free; REACH SVHC: No SVHC; ComponentLink1URL: https://datasheet.ciiva.com/23810/1700986-23810482.pdf?src-supplier=Newark; ComponentLink1Description: https://datasheet.ciiva.com/23810/1700986-23810482.pdf?src-supplier=Newark; ComponentLink2URL: https://datasheet.ciiva.com/15116/getdatasheetpartid-719871-15116767.pdf?src-supplier=Verical; ComponentLink2Description: https://datasheet.ciiva.com/15116/getdatasheetpartid-719871-15116767.pdf?src-supplier=Verical; ComponentLink3URL: https://datasheet.ciiva.com/16216/abs07-16216664.pdf?src-supplier=Future+Electronics; ComponentLink3Description: https://datasheet.ciiva.com/16216/abs07-16216664.pdf?src-supplier=Future+Electronics; ComponentLink4URL: https://datasheet.ciiva.com/6733/abs07-6733371.pdf?src-supplier=Digi-Key; ComponentLink4Description: https://datasheet.ciiva.com/6733/abs07-6733371.pdf?src-supplier=Digi-Key; ComponentLink5URL: https://datasheet.ciiva.com/6733/abs07-6733372.pdf?src-supplier=Digi-Key; ComponentLink5Description: https://datasheet.ciiva.com/6733/abs07-6733372.pdf?src-supplier=Digi-Key; ComponentLink6URL: https://datasheet.ciiva.com/12387/abs07-11028-12387292.pdf?src-supplier=Mouser; ComponentLink6Description: https://datasheet.ciiva.com/12387/abs07-11028-12387292.pdf?src-supplier=Mouser; ComponentLink7URL: https://datasheet.ciiva.com/6733/abs07-6733373.pdf?src-supplier=Digi-Key; ComponentLink7Description: https://datasheet.ciiva.com/6733/abs07-6733373.pdf?src-supplier=Digi-Key; Supplier Part Number 1: 13AC8084